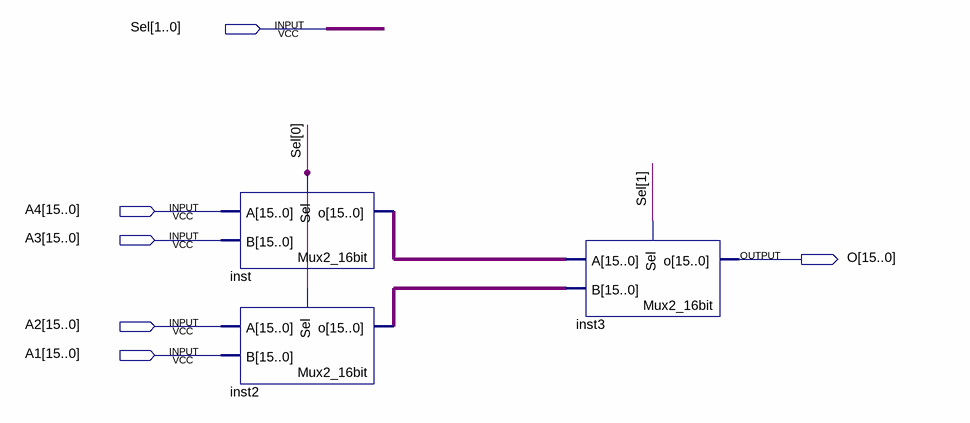
[diagram p0: schematic sheet]
// Quartus schematic Mux4_16bit.bdf as structural Verilog: 3 symbols, 6 pins
module Mux4_16bit (
  input  [1:0] Sel,
  input  [15:0] A4,
  input  [15:0] A3,
  input  [15:0] A2,
  input  [15:0] A1,
  output [15:0] O
);

  wire [15:0] inst2_o, inst_o;

  Mux2_16bit inst (.Sel(Sel[0]), .A(A4), .B(A3), .o(inst_o));
  Mux2_16bit inst2 (.Sel(Sel[0]), .A(A2), .B(A1), .o(inst2_o));
  Mux2_16bit inst3 (.Sel(Sel[1]), .A(inst_o), .B(inst2_o), .o(O));
endmodule
